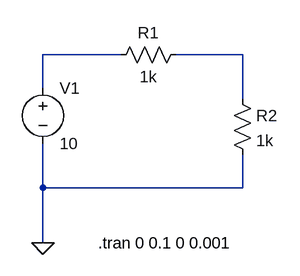
[diagram p0: schematic Draft2.asc]
Draft2.asc, the LTspice schematic file:
Version 4.1
SHEET 1 880 680
WIRE 208 80 96 80
WIRE 384 80 288 80
WIRE 96 128 96 80
WIRE 384 144 384 80
WIRE 96 272 96 208
WIRE 384 272 384 224
WIRE 384 272 96 272
WIRE 96 352 96 272
FLAG 96 352 0
SYMBOL voltage 96 112 R0
SYMATTR InstName V1
SYMATTR Value 10
SYMBOL res 368 128 R0
SYMATTR InstName R2
SYMATTR Value 1k
SYMBOL res 304 64 R90
WINDOW 0 0 56 VBottom 2
WINDOW 3 32 56 VTop 2
SYMATTR InstName R1
SYMATTR Value 1k
TEXT 176 352 Left 2 !.tran 0 0.1 0 0.001

The netlist it stands for:
* Draft2.asc
V1 N001 0 10
R2 N002 0 1k
R1 N002 N001 1k
.tran 0 0.1 0 0.001
.backanno
.end